# Altium schematic sheet WaterLevelRF.SchDoc
size A4
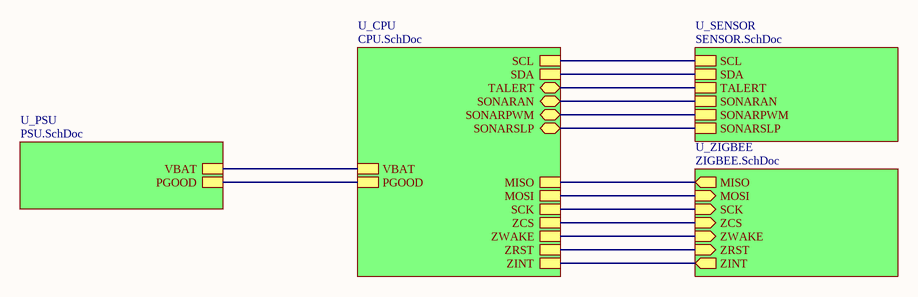
[diagram p0: WaterLevelRF.SchDoc]

## Sub-sheets
U_CPU = CPU.SchDoc: MOSI, MISO, SCK, ZCS, ZWAKE, ZRST, SCL, SDA, VBAT, ZINT, PGOOD, SONARAN, SONARPWM, SONARSLP, TALERT
U_PSU = PSU.SchDoc: PGOOD, VBAT
U_SENSOR = SENSOR.SchDoc: SCL, SDA, TALERT, SONARAN, SONARPWM, SONARSLP
U_ZIGBEE = ZIGBEE.SchDoc: MISO (out), MOSI (in), SCK (in), ZINT (out), ZCS (in), ZWAKE (in), ZRST (in)

## Nets
(unnamed): sheet U_SENSOR/SCL, sheet U_CPU/SCL
(unnamed): sheet U_SENSOR/SDA, sheet U_CPU/SDA
(unnamed): sheet U_SENSOR/TALERT, sheet U_CPU/TALERT
(unnamed): sheet U_SENSOR/SONARAN, sheet U_CPU/SONARAN
(unnamed): sheet U_SENSOR/SONARPWM, sheet U_CPU/SONARPWM
(unnamed): sheet U_SENSOR/SONARSLP, sheet U_CPU/SONARSLP
(unnamed): sheet U_ZIGBEE/MISO, sheet U_CPU/MISO
(unnamed): sheet U_ZIGBEE/MOSI, sheet U_CPU/MOSI
(unnamed): sheet U_ZIGBEE/SCK, sheet U_CPU/SCK
(unnamed): sheet U_ZIGBEE/ZINT, sheet U_CPU/ZINT
(unnamed): sheet U_ZIGBEE/ZCS, sheet U_CPU/ZCS
(unnamed): sheet U_ZIGBEE/ZWAKE, sheet U_CPU/ZWAKE
(unnamed): sheet U_ZIGBEE/ZRST, sheet U_CPU/ZRST
(unnamed): sheet U_CPU/VBAT, sheet U_PSU/VBAT
(unnamed): sheet U_CPU/PGOOD, sheet U_PSU/PGOOD